# Altium schematic sheet Temp In.SchDoc
size A4; SheetNumber: 9; SheetTotal: 9
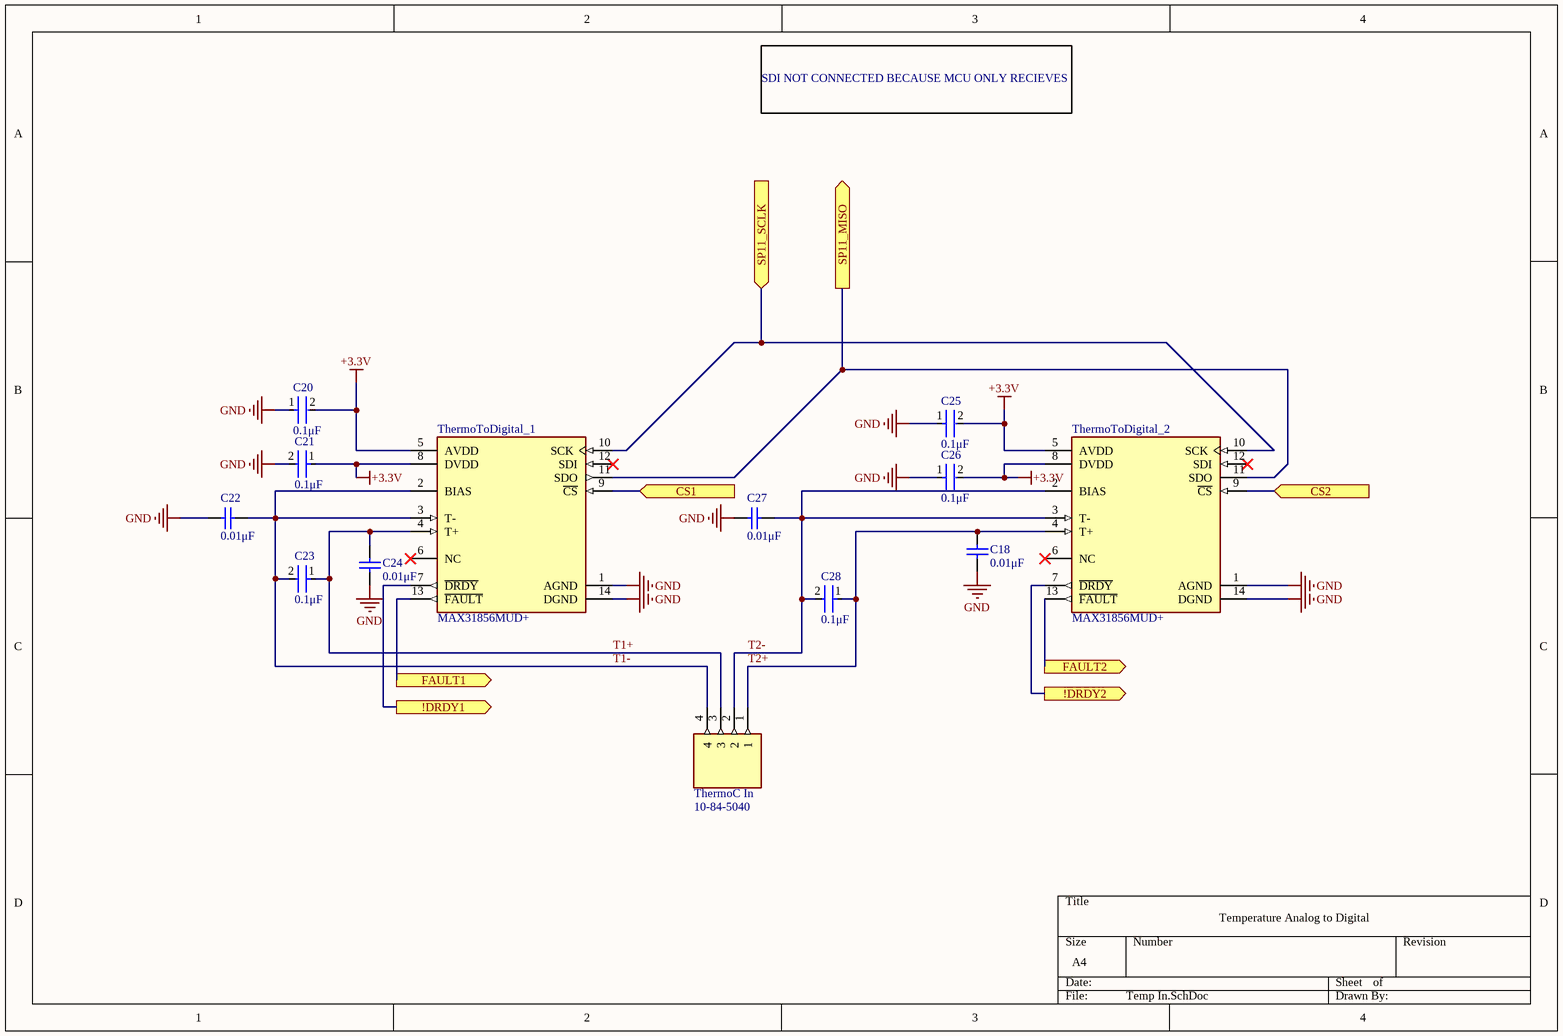
[diagram p0: Temp In.SchDoc]

## Parts
C18  0.01μF  [CAPC1608X90X35ML10T15]
C20  0.1μF  [FP-C0603C-CF-MFG]
C21  0.1μF  [FP-C0603C-CF-MFG]
C22  0.01μF  [CAPC1608X90X35ML10T15]
C23  0.1μF  [FP-C0603C-CF-MFG]
C24  0.01μF  [CAPC1608X90X35ML10T15]
C25  0.1μF  [FP-C0603C-CF-MFG]
C26  0.1μF  [FP-C0603C-CF-MFG]
C27  0.01μF  [CAPC1608X90X35ML10T15]
C28  0.1μF  [FP-C0603C-CF-MFG]
ThermoC_In  10-84-5040  [10845040]
ThermoToDigital_1  MAX31856MUD+  [FP-U14-2-MFG]
ThermoToDigital_2  MAX31856MUD+  [FP-U14-2-MFG]

## Ports
!DRDY1 (out), !DRDY2 (out), CS1 (in), CS2 (in), FAULT1 (out), FAULT2 (out), SP11_MISO (out), SP11_SCLK (in)

## Nets
+3.3V: C20.2 C21.1 C25.2 C26.2 ThermoToDigital_1.5(AVDD) ThermoToDigital_1.8(DVDD) ThermoToDigital_2.5(AVDD) ThermoToDigital_2.8(DVDD)
GND: C18.1 C20.1 C21.2 C22.2 C24.1 C25.1 C26.1 C27.2 ThermoToDigital_1.1(AGND) ThermoToDigital_1.14(DGND) ThermoToDigital_2.1(AGND) ThermoToDigital_2.14(DGND)
!DRDY1: ThermoToDigital_1.7(~{DRDY}) ; port !DRDY1
!DRDY2: ThermoToDigital_2.7(~{DRDY}) ; port !DRDY2
CS1: ThermoToDigital_1.9(~{CS}) ; port CS1
CS2: ThermoToDigital_2.9(~{CS}) ; port CS2
FAULT1: ThermoToDigital_1.13(~{FAULT}) ; port FAULT1
FAULT2: ThermoToDigital_2.13(~{FAULT}) ; port FAULT2
SP11_MISO: ThermoToDigital_1.11(SDO) ThermoToDigital_2.11(SDO) ; port SP11_MISO
SP11_SCLK: ThermoToDigital_1.10(SCK) ThermoToDigital_2.10(SCK) ; port SP11_SCLK
T1+: C23.1 C24.2 ThermoC_In.3 ThermoToDigital_1.4(T+)
T1-: C22.1 C23.2 ThermoC_In.4 ThermoToDigital_1.2(BIAS) ThermoToDigital_1.3(T-)
T2+: C18.2 C28.1 ThermoC_In.1 ThermoToDigital_2.4(T+)
T2-: C27.1 C28.2 ThermoC_In.2 ThermoToDigital_2.2(BIAS) ThermoToDigital_2.3(T-)

Not connected (* = marked no-connect by the designer): ThermoToDigital_1 6(NC)* 12(SDI)*; ThermoToDigital_2 6(NC)* 12(SDI)*

## Notes on the sheet
- SDI NOT CONNECTED BECAUSE MCU ONLY RECIEVES
- Temperature Analog to Digital

## Library data of the parts
C18 C22 C24 C27 = CMP-2100-03642-1: Chip Capacitor, 10 nF, +/- 10%, 50 V, -55 to 125 degC, 0603 (1608 Metric), RoHS, Tape and Reel; Manufacturer: Murata; Insulation Resistance: 10GR; Dielectric: X7R; Voltage Rating: 50V; Capacitance: 10nF; Material: Ceramic; Package Quantity: 1; Lead Free: LeadFree; Case/Package: 0603; Termination: SMD/SMT; REACH SVHC: Unknown; Manufacturer URL: http://www.murata.com/; Datasheet URL: http://search.murata.co.jp/Ceramy/image/img/A01X/G101/ENG/GRM188R71H103KA01-01.pdf; Mount: SurfaceMount; Datasheet Version: 42401.0; Number of Pins: 2; Length: 1.6mm; Voltage: 50V; Depth: 0.8mm; Tolerance: 10%; Min Operating Temperature: -55degC; Voltage Rating (DC): 50V; Max Operating Temperature: 125degC; Package Description: 2-Pin Surface Mount Device, Body 1.6 x 0.8 mm; RoHSCompliant: True; Case Code (Imperial): 0603; Width: 0.031inch; Case Code (Metric): 1608; Height: 0.8mm; Package Reference: 0603; Packaging: TapeandReel; Thickness: 0.035inch; Dielectric Material: Ceramic
C20 C21 C23 C25 C26 C28 = CMP-2006-03061-2: CAP CER 0.1UF 50V X7R 0603; Manufacturer: KEMET; Manufacturer Part Number: C0603C104K5RACTU; Tolerance: 0.1; Temperature Coefficient: 30ppm/°C; Material: Ceramic; Automotive Grade: Grade 1; Value: 0.10 μF; Temperature: -55°C to +125°C; RoHS: TRUE; Temperature Range High: +125°C; Lead Free: Yes; Octopart: https://octopart.com/c0603c104k5ractu-kemet-139244; Digikey Description: CAP CER 0.1UF 50V X7R 0603; Category: Cap; Package: C0603C-CF; ComponentLink2Description: Datasheet; Temperature Range Low: -55°C; Device Class L1: Passive Components; Voltage Rating: 50 V; Automotive: Yes; Device Class L3: Ceramic Capacitors; ComponentLink2URL: https://api.kemet.com/component-edge/download/datasheet/C0603C100J5GACAUTO.pdf; Capacitance: 0.10 μF; Device Class L2: Capacitors; Temperature Characteristic: X7R; Height: 0.87mm
ThermoC_In = 10-84-5040: Connector; Manufacturer_Name: Molex; Datasheet Link: https://www.molex.com/pdm_docs/sd/010845040_sd.pdf; Height: 14.22mm; Manufacturer_Part_Number: 10-84-5040
ThermoToDigital_1 ThermoToDigital_2 = CMP-05752-000010-1: IC CONV THERMOCOUPLE 14TSSOP; Operating Supply Current: 1.2mA; Min Supply Voltage: 3V; Max Supply Voltage: 3.6V; Output Type: Digital; Interface: SPI; Min Operating Temperature: -55°C; Max Operating Temperature: 125°C; Case/Package: TSSOP; Mount: Surface Mount; Packaging: Rail/Tube; Number of Pins: 14